# Altium schematic sheet 00_Overview.SchDoc
size A; SheetNumber: 1; SheetTotal: 7
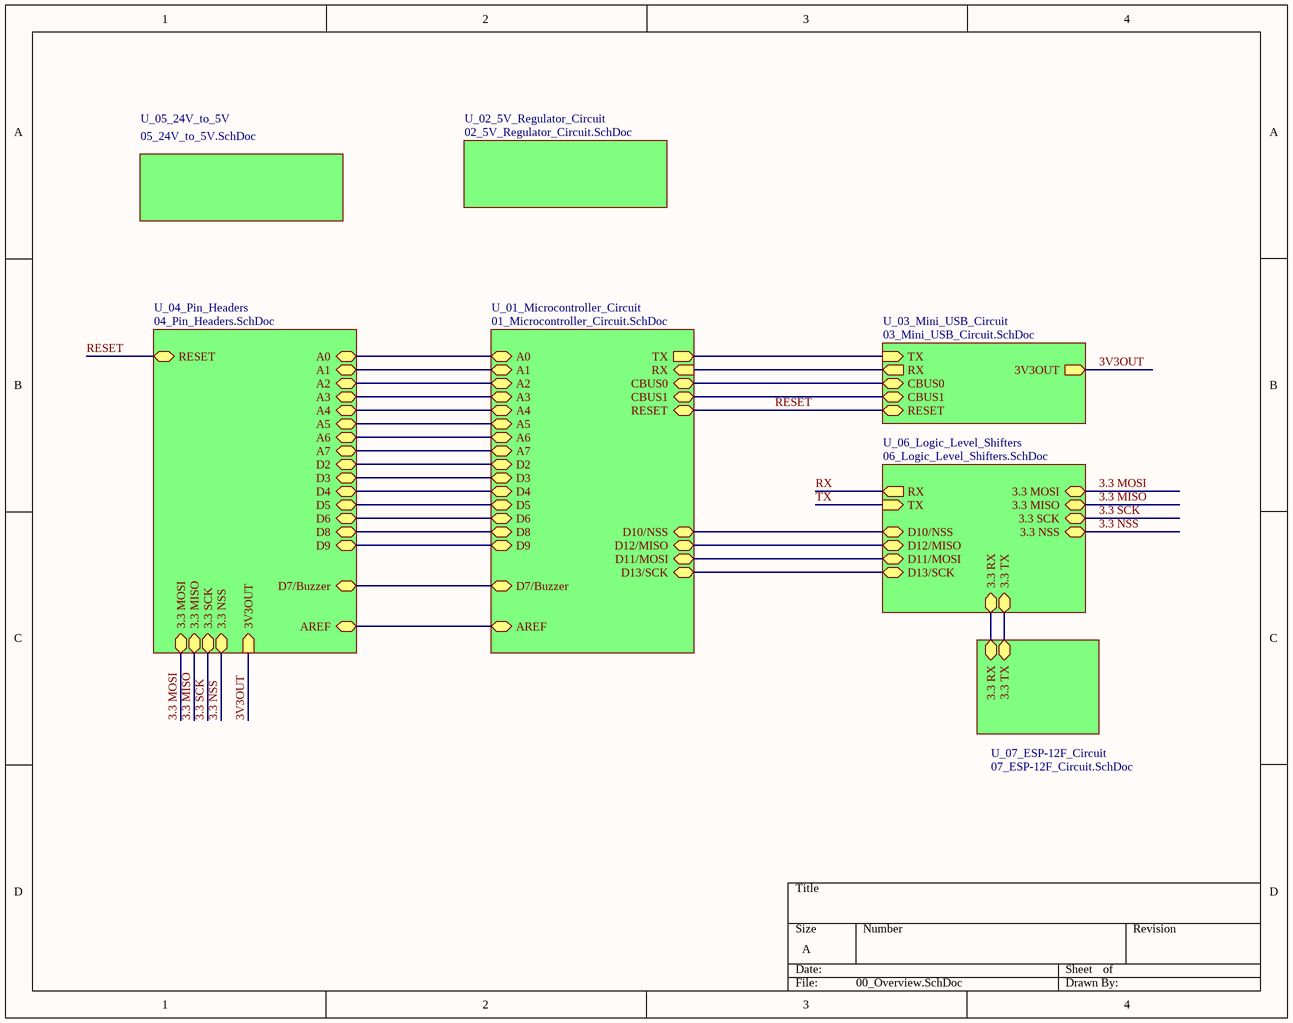
[diagram p0: 00_Overview.SchDoc]

## Sub-sheets
U_01_Microcontroller_Circuit = 01_Microcontroller_Circuit.SchDoc: RX (in), TX (out), A0 (bidir), A1 (bidir), A2 (bidir), A3 (bidir), A4 (bidir), A5 (bidir), A6 (bidir), A7 (bidir), D2 (bidir), D3 (bidir), D4 (bidir), D5 (bidir), D6 (bidir), D8 (bidir), D9 (bidir), RESET (bidir), CBUS0 (bidir), CBUS1 (bidir), D11/MOSI (bidir), D12/MISO (bidir), AREF (bidir), D13/SCK (bidir), D10/NSS (bidir), D7/Buzzer (bidir)
U_02_5V_Regulator_Circuit = 02_5V_Regulator_Circuit.SchDoc: no entries
U_03_Mini_USB_Circuit = 03_Mini_USB_Circuit.SchDoc: TX (in), RX (out), RESET (bidir), CBUS0 (bidir), CBUS1 (bidir), 3V3OUT (out)
U_04_Pin_Headers = 04_Pin_Headers.SchDoc: RESET (bidir), D2 (bidir), D3 (bidir), D4 (bidir), D5 (bidir), D6 (bidir), D8 (bidir), D9 (bidir), A1 (bidir), A0 (bidir), AREF (bidir), A6 (bidir), A5 (bidir), A4 (bidir), A3 (bidir), A2 (bidir), A7 (bidir), D7/Buzzer (bidir), 3.3 MOSI (bidir), 3.3 NSS (bidir), 3.3 MISO (bidir), 3.3 SCK (bidir), 3V3OUT (in)
U_05_24V_to_5V = 05_24V_to_5V.SchDoc: no entries
U_06_Logic_Level_Shifters = 06_Logic_Level_Shifters.SchDoc: 3.3 NSS (bidir), 3.3 MISO (bidir), 3.3 MOSI (bidir), 3.3 SCK (bidir), D10/NSS (bidir), D12/MISO (bidir), D11/MOSI (bidir), D13/SCK (bidir), TX (in), RX (out), 3.3 RX (bidir), 3.3 TX (bidir)
U_07_ESP-12F_Circuit = 07_ESP-12F_Circuit.SchDoc: 3.3 TX (bidir), 3.3 RX (bidir)

## Nets
3.3 MISO: sheet U_04_Pin_Headers/3.3 MISO, sheet U_06_Logic_Level_Shifters/3.3 MISO
3.3 MOSI: sheet U_04_Pin_Headers/3.3 MOSI, sheet U_06_Logic_Level_Shifters/3.3 MOSI
3.3 NSS: sheet U_04_Pin_Headers/3.3 NSS, sheet U_06_Logic_Level_Shifters/3.3 NSS
3.3 SCK: sheet U_04_Pin_Headers/3.3 SCK, sheet U_06_Logic_Level_Shifters/3.3 SCK
3V3OUT: sheet U_04_Pin_Headers/3V3OUT, sheet U_03_Mini_USB_Circuit/3V3OUT
RESET: sheet U_01_Microcontroller_Circuit/RESET, sheet U_04_Pin_Headers/RESET, sheet U_03_Mini_USB_Circuit/RESET
RX: sheet U_06_Logic_Level_Shifters/RX
TX: sheet U_06_Logic_Level_Shifters/TX
(unnamed): sheet U_01_Microcontroller_Circuit/RX, sheet U_03_Mini_USB_Circuit/RX
(unnamed): sheet U_01_Microcontroller_Circuit/TX, sheet U_03_Mini_USB_Circuit/TX
(unnamed): sheet U_01_Microcontroller_Circuit/A0, sheet U_04_Pin_Headers/A0
(unnamed): sheet U_01_Microcontroller_Circuit/A1, sheet U_04_Pin_Headers/A1
(unnamed): sheet U_01_Microcontroller_Circuit/A2, sheet U_04_Pin_Headers/A2
(unnamed): sheet U_01_Microcontroller_Circuit/A3, sheet U_04_Pin_Headers/A3
(unnamed): sheet U_01_Microcontroller_Circuit/A4, sheet U_04_Pin_Headers/A4
(unnamed): sheet U_01_Microcontroller_Circuit/A5, sheet U_04_Pin_Headers/A5
(unnamed): sheet U_01_Microcontroller_Circuit/A6, sheet U_04_Pin_Headers/A6
(unnamed): sheet U_01_Microcontroller_Circuit/A7, sheet U_04_Pin_Headers/A7
(unnamed): sheet U_01_Microcontroller_Circuit/D2, sheet U_04_Pin_Headers/D2
(unnamed): sheet U_01_Microcontroller_Circuit/D3, sheet U_04_Pin_Headers/D3
(unnamed): sheet U_01_Microcontroller_Circuit/D4, sheet U_04_Pin_Headers/D4
(unnamed): sheet U_01_Microcontroller_Circuit/D5, sheet U_04_Pin_Headers/D5
(unnamed): sheet U_01_Microcontroller_Circuit/D6, sheet U_04_Pin_Headers/D6
(unnamed): sheet U_01_Microcontroller_Circuit/D8, sheet U_04_Pin_Headers/D8
(unnamed): sheet U_01_Microcontroller_Circuit/D9, sheet U_04_Pin_Headers/D9
(unnamed): sheet U_01_Microcontroller_Circuit/CBUS0, sheet U_03_Mini_USB_Circuit/CBUS0
(unnamed): sheet U_01_Microcontroller_Circuit/CBUS1, sheet U_03_Mini_USB_Circuit/CBUS1
(unnamed): sheet U_01_Microcontroller_Circuit/D11/MOSI, sheet U_06_Logic_Level_Shifters/D11/MOSI
(unnamed): sheet U_01_Microcontroller_Circuit/D12/MISO, sheet U_06_Logic_Level_Shifters/D12/MISO
(unnamed): sheet U_01_Microcontroller_Circuit/AREF, sheet U_04_Pin_Headers/AREF
(unnamed): sheet U_01_Microcontroller_Circuit/D13/SCK, sheet U_06_Logic_Level_Shifters/D13/SCK
(unnamed): sheet U_01_Microcontroller_Circuit/D10/NSS, sheet U_06_Logic_Level_Shifters/D10/NSS
(unnamed): sheet U_01_Microcontroller_Circuit/D7/Buzzer, sheet U_04_Pin_Headers/D7/Buzzer
(unnamed): sheet U_07_ESP-12F_Circuit/3.3 TX, sheet U_06_Logic_Level_Shifters/3.3 TX
(unnamed): sheet U_07_ESP-12F_Circuit/3.3 RX, sheet U_06_Logic_Level_Shifters/3.3 RX